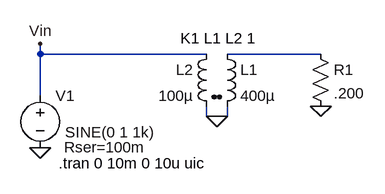
[diagram p0: schematic Transformer.asc]
Transformer.asc, the LTspice schematic file:
Version 4
SHEET 1 880 680
WIRE 80 224 80 208
WIRE 336 224 80 224
WIRE 512 224 368 224
WIRE 80 288 80 224
WIRE 336 320 336 304
WIRE 352 320 336 320
WIRE 368 320 368 304
WIRE 368 320 352 320
FLAG 80 368 0
FLAG 80 208 Vin
FLAG 352 320 0
FLAG 512 304 0
SYMBOL voltage 80 272 R0
WINDOW 3 38 72 Left 2
WINDOW 123 0 0 Left 0
WINDOW 39 37 95 Left 2
SYMATTR InstName V1
SYMATTR Value SINE(0 1 1k)
SYMATTR SpiceLine Rser=100m
SYMBOL ind2 352 208 R0
SYMATTR InstName L1
SYMATTR Value 400µ
SYMATTR Type ind
SYMBOL ind2 352 208 M0
SYMATTR InstName L2
SYMATTR Value 100µ
SYMATTR Type ind
SYMBOL res 496 208 R0
SYMATTR InstName R1
SYMATTR Value .200
TEXT 108 392 Left 2 !.tran 0 10m 0 10u uic
TEXT 296 200 Left 2 !K1 L1 L2 1

The netlist it stands for:
* Transformer.asc
V1 Vin 0 SINE(0 1 1k) Rser=100m
L1 N001 0 400µ
L2 Vin 0 100µ
R1 N001 0 .200
.tran 0 10m 0 10u uic
K1 L1 L2 1
.backanno
.end